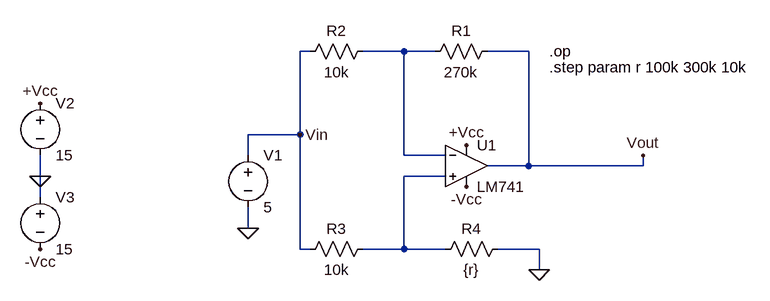
[diagram p0: schematic Expt5_DC Null.asc]
Expt5_DC Null.asc, the LTspice schematic file:
Version 4
SHEET 1 880 680
WIRE 0 0 -16 0
WIRE 144 0 80 0
WIRE 192 0 144 0
WIRE 336 0 272 0
WIRE -16 128 -16 0
WIRE -16 128 -96 128
WIRE -96 160 -96 128
WIRE 144 160 144 0
WIRE 208 160 144 160
WIRE 336 176 336 0
WIRE 336 176 272 176
WIRE 512 176 512 160
WIRE 512 176 336 176
WIRE -416 192 -416 160
WIRE 208 192 144 192
WIRE -416 224 -416 192
WIRE -96 272 -96 240
WIRE -16 304 -16 128
WIRE 0 304 -16 304
WIRE 144 304 144 192
WIRE 144 304 80 304
WIRE 208 304 144 304
WIRE 352 304 288 304
WIRE 352 336 352 304
FLAG -96 272 0
FLAG 352 336 0
FLAG -416 192 0
FLAG -416 80 +Vcc
FLAG 240 144 +Vcc
FLAG -416 304 -Vcc
FLAG 240 208 -Vcc
FLAG 512 160 Vout
FLAG -16 128 Vin
SYMBOL Opamps\\LM741 240 112 R0
SYMATTR InstName U1
SYMBOL res 288 -16 R90
WINDOW 0 0 56 VBottom 2
WINDOW 3 32 56 VTop 2
SYMATTR InstName R1
SYMATTR Value 270k
SYMBOL res 96 -16 R90
WINDOW 0 0 56 VBottom 2
WINDOW 3 32 56 VTop 2
SYMATTR InstName R2
SYMATTR Value 10k
SYMBOL res 96 288 R90
WINDOW 0 0 56 VBottom 2
WINDOW 3 32 56 VTop 2
SYMATTR InstName R3
SYMATTR Value 10k
SYMBOL res 304 288 R90
WINDOW 0 0 56 VBottom 2
WINDOW 3 32 56 VTop 2
SYMATTR InstName R4
SYMATTR Value {r}
SYMBOL voltage -96 144 R0
WINDOW 123 0 0 Left 2
WINDOW 39 0 0 Left 2
SYMATTR InstName V1
SYMATTR Value 5
SYMBOL voltage -416 64 R0
WINDOW 123 0 0 Left 2
WINDOW 39 0 0 Left 2
SYMATTR InstName V2
SYMATTR Value 15
SYMBOL voltage -416 208 R0
WINDOW 123 0 0 Left 2
WINDOW 39 0 0 Left 2
SYMATTR InstName V3
SYMATTR Value 15
TEXT 368 24 Left 2 !.step param r 100k 300k 10k
TEXT 368 0 Left 2 !.op

The netlist it stands for:
* Expt5_DC Null.asc
XU1 N002 N001 +Vcc -Vcc Vout LM741  ; pins In+ In- V+ V- OUT
R1 Vout N001 270k
R2 N001 Vin 10k
R3 N002 Vin 10k
R4 0 N002 {r}
V1 Vin 0 5
V2 +Vcc 0 15
V3 0 -Vcc 15
.step param r 100k 300k 10k
.op
.lib LM741.lib
.backanno
.end